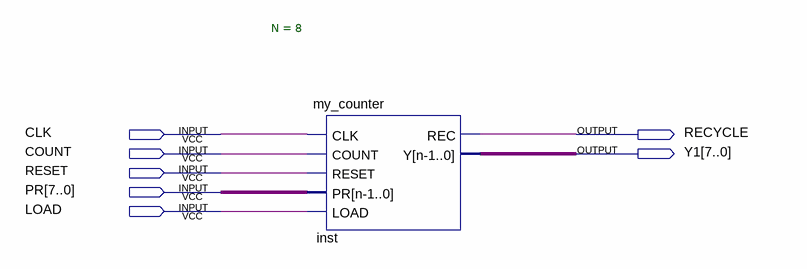
[diagram p0: schematic sheet]
// Quartus schematic behavioural.bdf as structural Verilog: 1 symbols, 7 pins
module behavioural (
  input  CLK,
  input  COUNT,
  input  RESET,
  input  [7:0] PR,
  input  LOAD,
  output RECYCLE,
  output [7:0] Y1
);

  my_counter #(.N(8)) inst (.CLK(CLK), .COUNT(COUNT), .RESET(RESET), .PR(PR), .LOAD(LOAD), .REC(RECYCLE), .Y(Y1));
endmodule
